# Altium project ButtonPad.PrjPcb
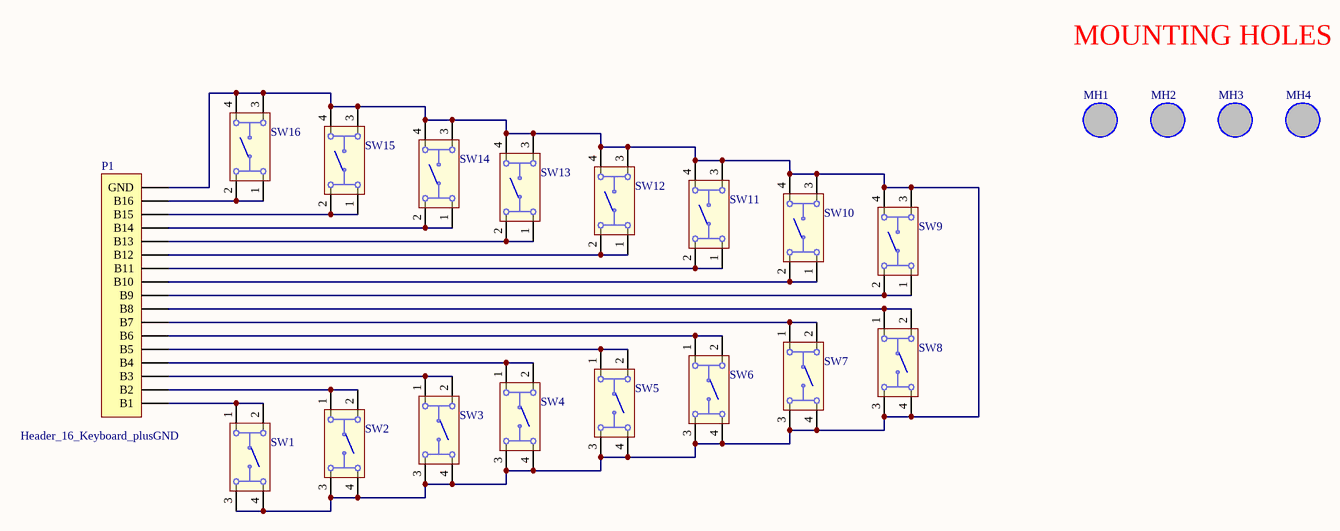
[diagram p0: ButtonPad.SchDoc]
1 sheet, 21 parts. Net scope: global (net labels, ports and power ports of the same name join across sheets).
Board file: ButtonPad.PcbDoc

## Sheet ButtonPad.SchDoc: ButtonPad
size A4; Author: Andrea Mancini; DocumentNumber: 1; Revision: 1; SheetNumber: 1; SheetTotal: 1; DescriptionLine1: Button Pad with; DescriptionLine2: 16 pushbutton NO; DescriptionLine3: Pressed when pin is LOW

### Parts
MH1  Mounting Hole 3.2mm Drill  [MH_3.2MMD]  (value not drawn)  (no BOM)
MH2  Mounting Hole 3.2mm Drill  [MH_3.2MMD]  (value not drawn)  (no BOM)
MH3  Mounting Hole 3.2mm Drill  [MH_3.2MMD]  (value not drawn)  (no BOM)
MH4  Mounting Hole 3.2mm Drill  [MH_3.2MMD]  (value not drawn)  (no BOM)
P1  Header_16_Keyboard_plusGND  [HDR1X16_Buttons_plusGND]
SW1  430456073736  [430456073736]  (value not drawn)
SW2  430456073736  [430456073736]  (value not drawn)
SW3  430456073736  [430456073736]  (value not drawn)
SW4  430456073736  [430456073736]  (value not drawn)
SW5  430456073736  [430456073736]  (value not drawn)
SW6  430456073736  [430456073736]  (value not drawn)
SW7  430456073736  [430456073736]  (value not drawn)
SW8  430456073736  [430456073736]  (value not drawn)
SW9  430456073736  [430456073736]  (value not drawn)
SW10  430456073736  [430456073736]  (value not drawn)
SW11  430456073736  [430456073736]  (value not drawn)
SW12  430456073736  [430456073736]  (value not drawn)
SW13  430456073736  [430456073736]  (value not drawn)
SW14  430456073736  [430456073736]  (value not drawn)
SW15  430456073736  [430456073736]  (value not drawn)
SW16  430456073736  [430456073736]  (value not drawn)

### Nets
NetP1_1: P1.1(B1) SW1.1 SW1.2
NetP1_2: P1.2(B2) SW2.1 SW2.2
NetP1_3: P1.3(B3) SW3.1 SW3.2
NetP1_4: P1.4(B4) SW4.1 SW4.2
NetP1_5: P1.5(B5) SW5.1 SW5.2
NetP1_6: P1.6(B6) SW6.1 SW6.2
NetP1_7: P1.7(B7) SW7.1 SW7.2
NetP1_8: P1.8(B8) SW8.1 SW8.2
NetP1_9: P1.9(B9) SW9.1 SW9.2
NetP1_10: P1.10(B10) SW10.1 SW10.2
NetP1_11: P1.11(B11) SW11.1 SW11.2
NetP1_12: P1.12(B12) SW12.1 SW12.2
NetP1_13: P1.13(B13) SW13.1 SW13.2
NetP1_14: P1.14(B14) SW14.1 SW14.2
NetP1_15: P1.15(B15) SW15.1 SW15.2
NetP1_16: P1.16(B16) SW16.1 SW16.2
NetP1_17: P1.17(GND) SW1.3 SW1.4 SW2.3 SW2.4 SW3.3 SW3.4 SW4.3 SW4.4 SW5.3 SW5.4 SW6.3 SW6.4 SW7.3 SW7.4 SW8.3 SW8.4 SW9.3 SW9.4 SW10.3 SW10.4 SW11.3 SW11.4 SW12.3 SW12.4 SW13.3 SW13.4 SW14.3 SW14.4 SW15.3 SW15.4 SW16.3 SW16.4

### Notes on the sheet
- MOUNTING HOLES
- Title
- Size:
- Date:
- A4
- Number:
- Time:
- Revision:
- Sheet
- of
- Author:
- File:

### Library data of the parts
MH1-MH4 = MH_3.2MMD
SW1-SW16 = 430456073736: WS-TATV THT Tact Switch 12X12 mm; Manufacturer: Wuerth Elektronik; NoPins: 04; ComponentLink1Description: Manufacturer URL; ComponentLink2Description: Datasheet; ComponentLink1URL: http://www.we-online.com; PartNumber: 430456073736; PackageReference: 430456073736; ComponentLink2URL: http://katalog.we-online.de/em/datasheet/430456073736.pdf